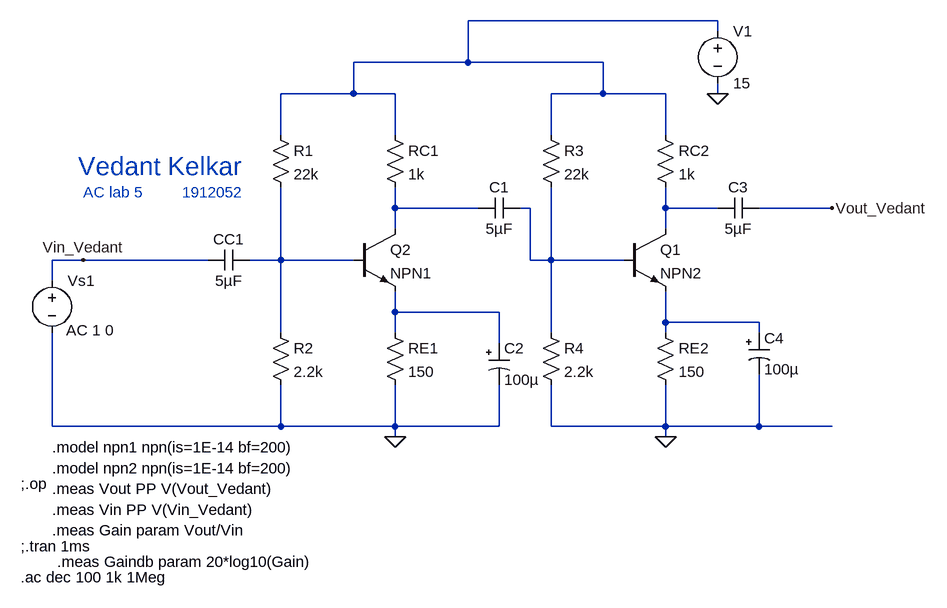
[diagram p0: schematic AC_lab5.asc]
AC_lab5.asc, the LTspice schematic file:
Version 4
SHEET 1 1400 776
WIRE 1056 -96 672 -96
WIRE 1056 -80 1056 -96
WIRE 672 -32 672 -96
WIRE 672 -32 496 -32
WIRE 880 -32 672 -32
WIRE 496 16 496 -32
WIRE 496 16 384 16
WIRE 560 16 496 16
WIRE 880 16 880 -32
WIRE 880 16 800 16
WIRE 976 16 880 16
WIRE 1056 16 1056 0
WIRE 384 80 384 16
WIRE 560 80 560 16
WIRE 800 80 800 16
WIRE 976 80 976 16
WIRE 560 192 560 160
WIRE 688 192 560 192
WIRE 768 192 752 192
WIRE 976 192 976 160
WIRE 1056 192 976 192
WIRE 1232 192 1120 192
WIRE 560 224 560 192
WIRE 976 224 976 192
WIRE 80 272 32 272
WIRE 272 272 80 272
WIRE 384 272 384 160
WIRE 384 272 336 272
WIRE 496 272 384 272
WIRE 768 272 768 192
WIRE 800 272 800 160
WIRE 800 272 768 272
WIRE 912 272 800 272
WIRE 32 304 32 272
WIRE 560 352 560 320
WIRE 720 352 560 352
WIRE 976 368 976 320
WIRE 1120 368 976 368
WIRE 384 384 384 272
WIRE 560 384 560 352
WIRE 800 384 800 272
WIRE 976 384 976 368
WIRE 1120 384 1120 368
WIRE 720 400 720 352
WIRE 32 528 32 384
WIRE 384 528 384 464
WIRE 384 528 32 528
WIRE 560 528 560 464
WIRE 560 528 384 528
WIRE 720 528 720 464
WIRE 720 528 560 528
WIRE 800 528 800 464
WIRE 976 528 976 464
WIRE 976 528 800 528
WIRE 1120 528 1120 448
WIRE 1120 528 976 528
WIRE 1232 528 1120 528
WIRE 560 544 560 528
WIRE 976 544 976 528
FLAG 560 544 0
FLAG 976 544 0
FLAG 1056 16 0
FLAG 80 272 Vin_Vedant
FLAG 1232 192 Vout_Vedant
SYMBOL res 368 64 R0
SYMATTR InstName R1
SYMATTR Value 22k
SYMBOL res 544 64 R0
SYMATTR InstName RC1
SYMATTR Value 1k
SYMBOL res 544 368 R0
SYMATTR InstName RE1
SYMATTR Value 150
SYMBOL res 368 368 R0
SYMATTR InstName R2
SYMATTR Value 2.2k
SYMBOL npn 912 224 R0
SYMATTR InstName Q1
SYMATTR Value NPN2
SYMBOL cap 336 256 R90
WINDOW 0 0 32 VBottom 2
WINDOW 3 32 32 VTop 2
SYMATTR InstName CC1
SYMATTR Value 5µF
SYMBOL voltage 32 288 R0
WINDOW 123 22 92 Left 2
WINDOW 39 0 0 Left 0
WINDOW 3 24 44 Left 2
SYMATTR Value2 AC 1 0
SYMATTR Value ""
SYMATTR InstName Vs1
SYMBOL cap 752 176 R90
WINDOW 0 0 32 VBottom 2
WINDOW 3 32 32 VTop 2
SYMATTR InstName C1
SYMATTR Value 5µF
SYMBOL polcap 704 400 R0
WINDOW 3 24 56 Left 2
SYMATTR Value 100µ
SYMATTR InstName C2
SYMATTR Description Capacitor
SYMATTR Type cap
SYMATTR SpiceLine V=4 Irms=3.72678 Rser=0.018 Lser=0 mfg="KEMET" pn="A700D107M004ATE018" type="Al electrolytic"
SYMBOL res 784 64 R0
SYMATTR InstName R3
SYMATTR Value 22k
SYMBOL res 784 368 R0
SYMATTR InstName R4
SYMATTR Value 2.2k
SYMBOL res 960 64 R0
SYMATTR InstName RC2
SYMATTR Value 1k
SYMBOL res 960 368 R0
SYMATTR InstName RE2
SYMATTR Value 150
SYMBOL npn 496 224 R0
SYMATTR InstName Q2
SYMATTR Value NPN1
SYMBOL cap 1120 176 R90
WINDOW 0 0 32 VBottom 2
WINDOW 3 32 32 VTop 2
SYMATTR InstName C3
SYMATTR Value 5µF
SYMBOL polcap 1104 384 R0
WINDOW 3 24 56 Left 2
SYMATTR Value 100µ
SYMATTR InstName C4
SYMATTR Description Capacitor
SYMATTR Type cap
SYMATTR SpiceLine V=4 Irms=3.72678 Rser=0.018 Lser=0 mfg="KEMET" pn="A700D107M004ATE018" type="Al electrolytic"
SYMBOL voltage 1056 -96 R0
WINDOW 123 0 0 Left 0
WINDOW 39 0 0 Left 0
SYMATTR InstName V1
SYMATTR Value 15
TEXT 72 128 Left 4 ;Vedant Kelkar
TEXT 80 168 Left 2 ;AC lab 5
TEXT 232 168 Left 2 ;1912052
TEXT 32 560 Left 2 !.model npn1 npn(is=1E-14 bf=200)
TEXT 32 592 Left 2 !.model npn2 npn(is=1E-14 bf=200)
TEXT -16 616 Left 2 !;.op
TEXT 32 624 Left 2 !.meas Vout PP V(Vout_Vedant)
TEXT 32 656 Left 2 !.meas Vin PP V(Vin_Vedant)
TEXT 32 688 Left 2 !.meas Gain param Vout/Vin
TEXT -16 712 Left 2 !;.tran 1ms
TEXT 40 736 Left 2 !.meas Gaindb param 20*log10(Gain)
TEXT -16 760 Left 2 !.ac dec 100 1k 1Meg

The netlist it stands for:
* AC_lab5.asc
R1 N001 N005 22k
RC1 N001 N002 1k
RE1 N006 0 150
R2 N005 0 2.2k
Q1 N004 N003 N007 0 NPN2
CC1 N005 Vin_Vedant 5µF
Vs1 Vin_Vedant 0 AC 1 0
C1 N003 N002 5µF
C2 N006 0 100µ V=4 Irms=3.72678 Rser=0.018 Lser=0 mfg="KEMET" pn="A700D107M004ATE018" type="Al electrolytic"
R3 N001 N003 22k
R4 N003 0 2.2k
RC2 N001 N004 1k
RE2 N007 0 150
Q2 N002 N005 N006 0 NPN1
C3 Vout_Vedant N004 5µF
C4 N007 0 100µ V=4 Irms=3.72678 Rser=0.018 Lser=0 mfg="KEMET" pn="A700D107M004ATE018" type="Al electrolytic"
V1 N001 0 15
.model NPN NPN
.model PNP PNP
.lib standard.bjt
* Vedant Kelkar
* AC lab 5
* 1912052
.model npn1 npn(is=1E-14 bf=200)
.model npn2 npn(is=1E-14 bf=200)
;.op
.meas Vout PP V(Vout_Vedant)
.meas Vin PP V(Vin_Vedant)
.meas Gain param Vout/Vin
;.tran 1ms
.meas Gaindb param 20*log10(Gain)
.ac dec 100 1k 1Meg
.backanno
.end